# Altium schematic sheet cyc_v_som_B.SchDoc
size A3
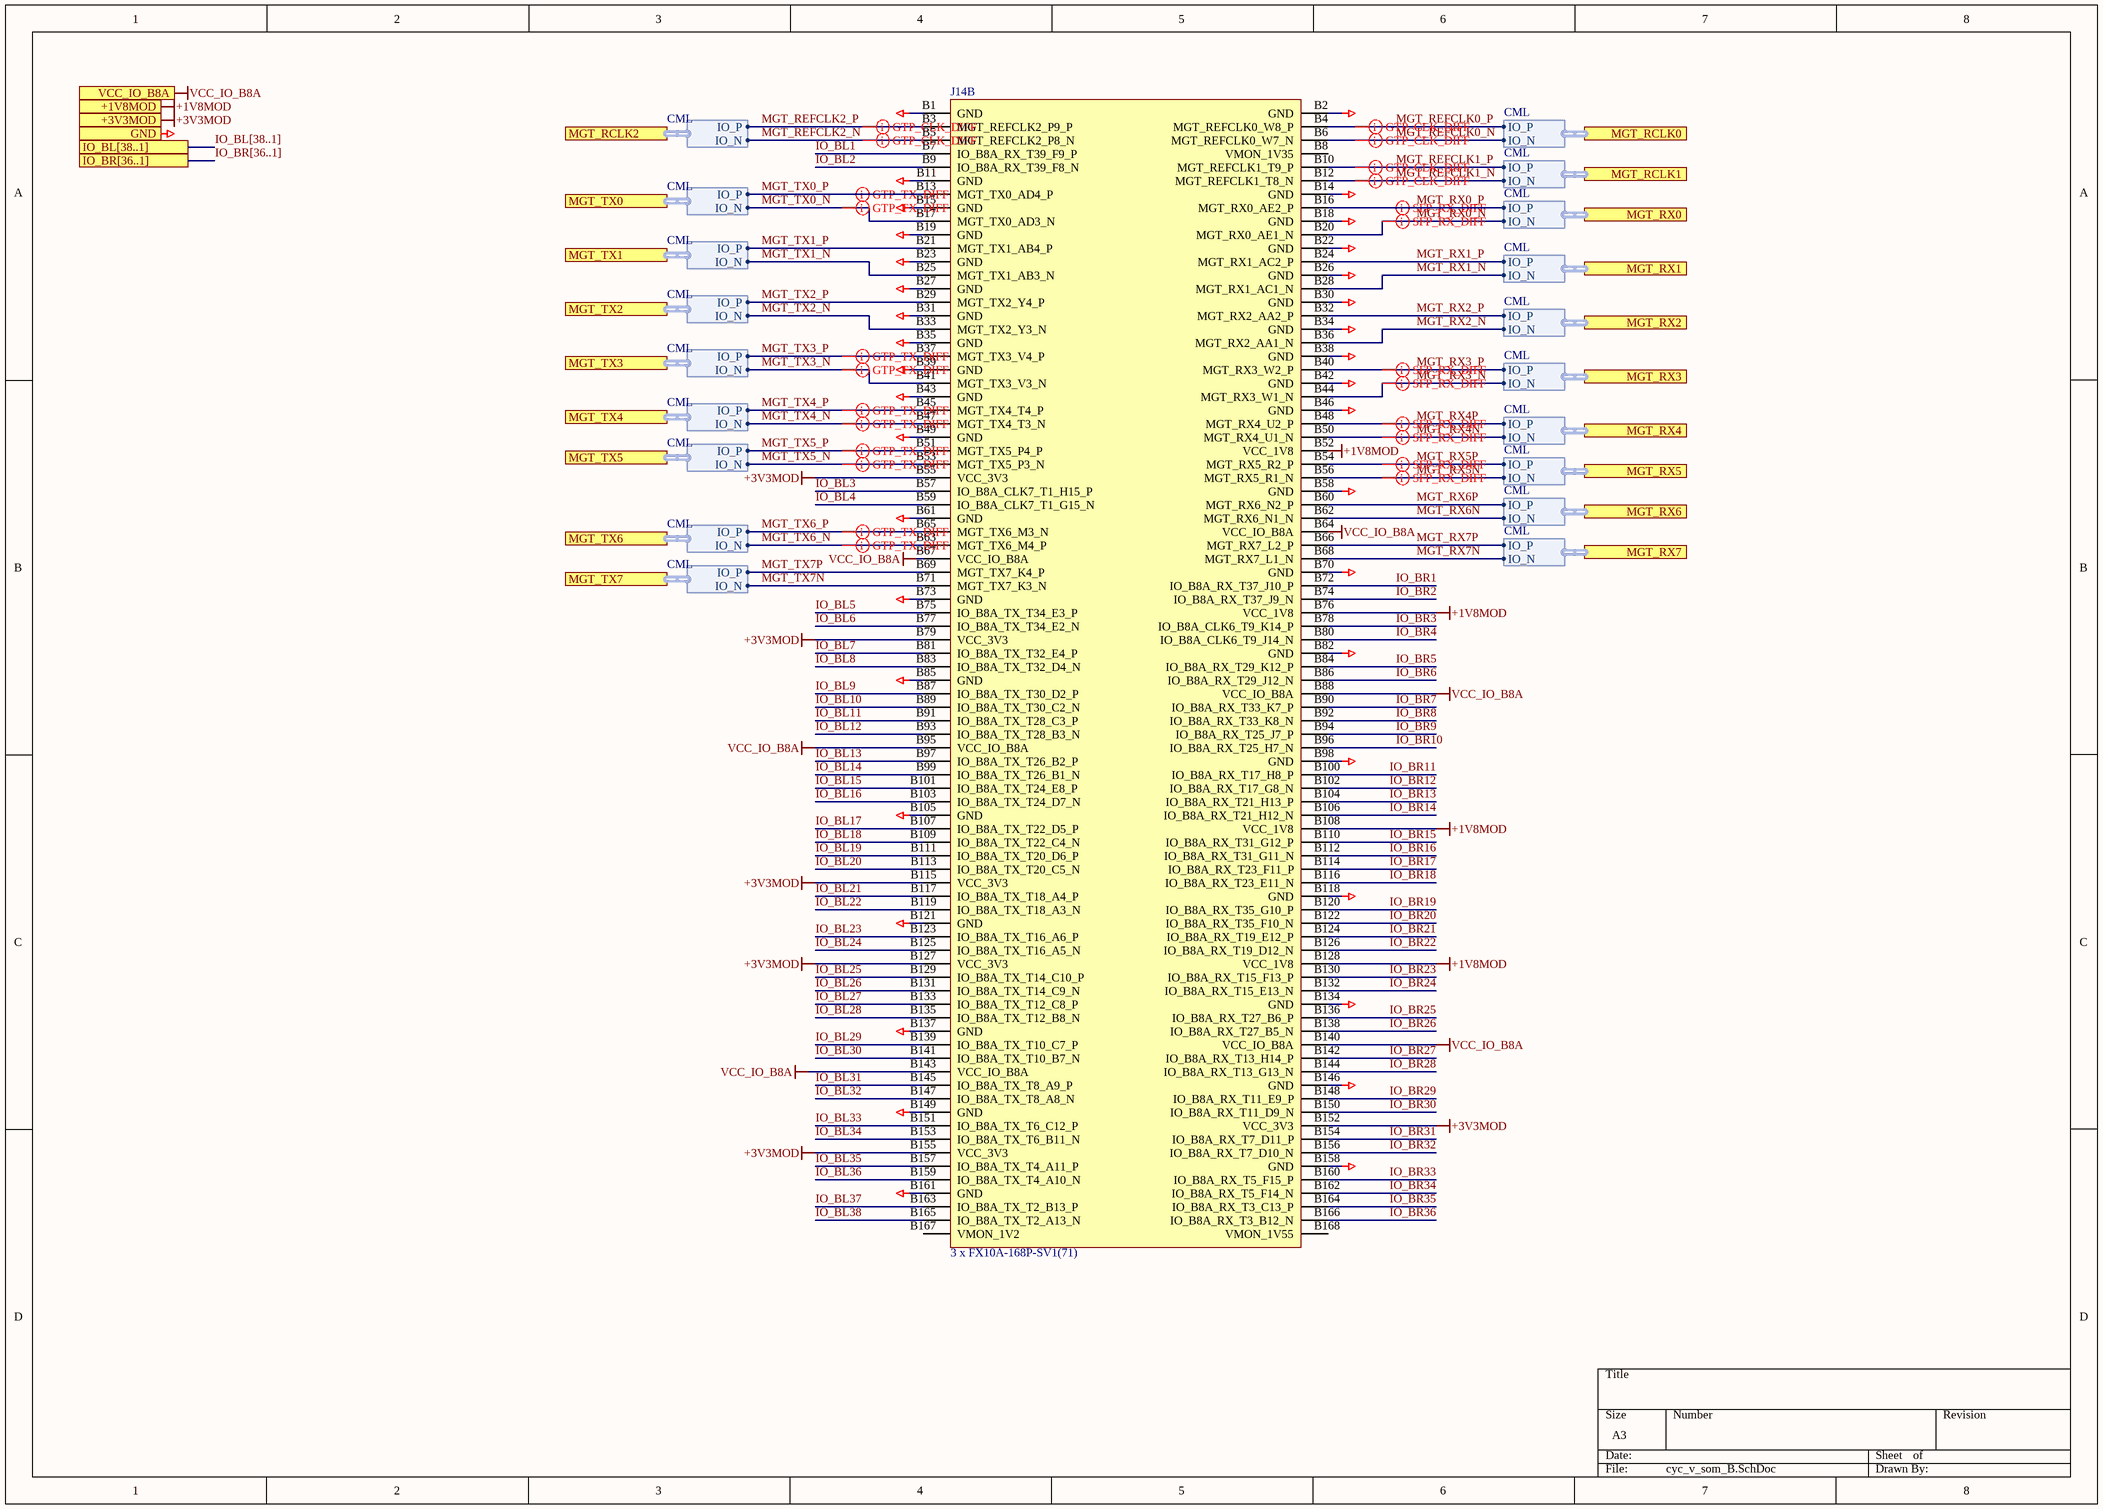
[diagram p0: cyc_v_som_B.SchDoc]

## Parts
J14  3 x FX10A-168P-SV1(71)  [Mercury_SA2p]  (part B of 4)

## Ports
+1V8MOD, +3V3MOD, GND, IO_BL[38..1], IO_BR[36..1], MGT_RCLK0 (harness CML), MGT_RCLK1 (harness CML), MGT_RCLK2 (harness CML), MGT_RX0 (harness CML), MGT_RX1 (harness CML), MGT_RX2 (harness CML), MGT_RX3 (harness CML), MGT_RX4 (harness CML), MGT_RX5 (harness CML), MGT_RX6 (harness CML), MGT_RX7 (harness CML), MGT_TX0 (harness CML), MGT_TX1 (harness CML), MGT_TX2 (harness CML), MGT_TX3 (harness CML), MGT_TX4 (harness CML), MGT_TX5 (harness CML), MGT_TX6 (harness CML), MGT_TX7 (harness CML), VCC_IO_B8A

## Harnesses
CML: IO_N, IO_P

## Nets
+1V8MOD: J14.B52(VCC_1V8) J14.B76(VCC_1V8) J14.B108(VCC_1V8) J14.B128(VCC_1V8) ; port +1V8MOD
+3V3MOD: J14.B55(VCC_3V3) J14.B79(VCC_3V3) J14.B115(VCC_3V3) J14.B127(VCC_3V3) J14.B152(VCC_3V3) J14.B155(VCC_3V3) ; port +3V3MOD
GND: J14.B1(GND) J14.B2(GND) J14.B11(GND) J14.B14(GND) J14.B15(GND) J14.B18(GND) J14.B19(GND) J14.B22(GND) J14.B23(GND) J14.B26(GND) J14.B27(GND) J14.B30(GND) J14.B31(GND) J14.B34(GND) J14.B35(GND) J14.B38(GND) J14.B39(GND) J14.B42(GND) J14.B43(GND) J14.B46(GND) J14.B49(GND) J14.B58(GND) J14.B61(GND) J14.B70(GND) J14.B73(GND) J14.B82(GND) J14.B85(GND) J14.B98(GND) J14.B105(GND) J14.B118(GND) J14.B121(GND) J14.B134(GND) J14.B137(GND) J14.B146(GND) J14.B149(GND) J14.B158(GND) J14.B161(GND) ; port GND
VCC_IO_B8A: J14.B64(VCC_IO_B8A) J14.B67(VCC_IO_B8A) J14.B88(VCC_IO_B8A) J14.B95(VCC_IO_B8A) J14.B140(VCC_IO_B8A) J14.B143(VCC_IO_B8A) ; port VCC_IO_B8A
IO_BL1: J14.B7(IO_B8A_RX_T39_F9_P)
IO_BL2: J14.B9(IO_B8A_RX_T39_F8_N)
IO_BL3: J14.B57(IO_B8A_CLK7_T1_H15_P)
IO_BL4: J14.B59(IO_B8A_CLK7_T1_G15_N)
IO_BL5: J14.B75(IO_B8A_TX_T34_E3_P)
IO_BL6: J14.B77(IO_B8A_TX_T34_E2_N)
IO_BL7: J14.B81(IO_B8A_TX_T32_E4_P)
IO_BL8: J14.B83(IO_B8A_TX_T32_D4_N)
IO_BL9: J14.B87(IO_B8A_TX_T30_D2_P)
IO_BL10: J14.B89(IO_B8A_TX_T30_C2_N)
IO_BL11: J14.B91(IO_B8A_TX_T28_C3_P)
IO_BL12: J14.B93(IO_B8A_TX_T28_B3_N)
IO_BL13: J14.B97(IO_B8A_TX_T26_B2_P)
IO_BL14: J14.B99(IO_B8A_TX_T26_B1_N)
IO_BL15: J14.B101(IO_B8A_TX_T24_E8_P)
IO_BL16: J14.B103(IO_B8A_TX_T24_D7_N)
IO_BL17: J14.B107(IO_B8A_TX_T22_D5_P)
IO_BL18: J14.B109(IO_B8A_TX_T22_C4_N)
IO_BL19: J14.B111(IO_B8A_TX_T20_D6_P)
IO_BL20: J14.B113(IO_B8A_TX_T20_C5_N)
IO_BL21: J14.B117(IO_B8A_TX_T18_A4_P)
IO_BL22: J14.B119(IO_B8A_TX_T18_A3_N)
IO_BL23: J14.B123(IO_B8A_TX_T16_A6_P)
IO_BL24: J14.B125(IO_B8A_TX_T16_A5_N)
IO_BL25: J14.B129(IO_B8A_TX_T14_C10_P)
IO_BL26: J14.B131(IO_B8A_TX_T14_C9_N)
IO_BL27: J14.B133(IO_B8A_TX_T12_C8_P)
IO_BL28: J14.B135(IO_B8A_TX_T12_B8_N)
IO_BL29: J14.B139(IO_B8A_TX_T10_C7_P)
IO_BL30: J14.B141(IO_B8A_TX_T10_B7_N)
IO_BL31: J14.B145(IO_B8A_TX_T8_A9_P)
IO_BL32: J14.B147(IO_B8A_TX_T8_A8_N)
IO_BL33: J14.B151(IO_B8A_TX_T6_C12_P)
IO_BL34: J14.B153(IO_B8A_TX_T6_B11_N)
IO_BL35: J14.B157(IO_B8A_TX_T4_A11_P)
IO_BL36: J14.B159(IO_B8A_TX_T4_A10_N)
IO_BL37: J14.B163(IO_B8A_TX_T2_B13_P)
IO_BL38: J14.B165(IO_B8A_TX_T2_A13_N)
IO_BR1: J14.B72(IO_B8A_RX_T37_J10_P)
IO_BR2: J14.B74(IO_B8A_RX_T37_J9_N)
IO_BR3: J14.B78(IO_B8A_CLK6_T9_K14_P)
IO_BR4: J14.B80(IO_B8A_CLK6_T9_J14_N)
IO_BR5: J14.B84(IO_B8A_RX_T29_K12_P)
IO_BR6: J14.B86(IO_B8A_RX_T29_J12_N)
IO_BR7: J14.B90(IO_B8A_RX_T33_K7_P)
IO_BR8: J14.B92(IO_B8A_RX_T33_K8_N)
IO_BR9: J14.B94(IO_B8A_RX_T25_J7_P)
IO_BR10: J14.B96(IO_B8A_RX_T25_H7_N)
IO_BR11: J14.B100(IO_B8A_RX_T17_H8_P)
IO_BR12: J14.B102(IO_B8A_RX_T17_G8_N)
IO_BR13: J14.B104(IO_B8A_RX_T21_H13_P)
IO_BR14: J14.B106(IO_B8A_RX_T21_H12_N)
IO_BR15: J14.B110(IO_B8A_RX_T31_G12_P)
IO_BR16: J14.B112(IO_B8A_RX_T31_G11_N)
IO_BR17: J14.B114(IO_B8A_RX_T23_F11_P)
IO_BR18: J14.B116(IO_B8A_RX_T23_E11_N)
IO_BR19: J14.B120(IO_B8A_RX_T35_G10_P)
IO_BR20: J14.B122(IO_B8A_RX_T35_F10_N)
IO_BR21: J14.B124(IO_B8A_RX_T19_E12_P)
IO_BR22: J14.B126(IO_B8A_RX_T19_D12_N)
IO_BR23: J14.B130(IO_B8A_RX_T15_F13_P)
IO_BR24: J14.B132(IO_B8A_RX_T15_E13_N)
IO_BR25: J14.B136(IO_B8A_RX_T27_B6_P)
IO_BR26: J14.B138(IO_B8A_RX_T27_B5_N)
IO_BR27: J14.B142(IO_B8A_RX_T13_H14_P)
IO_BR28: J14.B144(IO_B8A_RX_T13_G13_N)
IO_BR29: J14.B148(IO_B8A_RX_T11_E9_P)
IO_BR30: J14.B150(IO_B8A_RX_T11_D9_N)
IO_BR31: J14.B154(IO_B8A_RX_T7_D11_P)
IO_BR32: J14.B156(IO_B8A_RX_T7_D10_N)
IO_BR33: J14.B160(IO_B8A_RX_T5_F15_P)
IO_BR34: J14.B162(IO_B8A_RX_T5_F14_N)
IO_BR35: J14.B164(IO_B8A_RX_T3_C13_P)
IO_BR36: J14.B166(IO_B8A_RX_T3_B12_N)
MGT_REFCLK0_N: J14.B6(MGT_REFCLK0_W7_N) ; port MGT_RCLK0.IO_N
MGT_REFCLK0_P: J14.B4(MGT_REFCLK0_W8_P) ; port MGT_RCLK0.IO_P
MGT_REFCLK1_N: J14.B12(MGT_REFCLK1_T8_N) ; port MGT_RCLK1.IO_N
MGT_REFCLK1_P: J14.B10(MGT_REFCLK1_T9_P) ; port MGT_RCLK1.IO_P
MGT_REFCLK2_N: J14.B5(MGT_REFCLK2_P8_N) ; port MGT_RCLK2.IO_N
MGT_REFCLK2_P: J14.B3(MGT_REFCLK2_P9_P) ; port MGT_RCLK2.IO_P
MGT_RX0_N: J14.B20(MGT_RX0_AE1_N) ; port MGT_RX0.IO_N
MGT_RX0_P: J14.B16(MGT_RX0_AE2_P) ; port MGT_RX0.IO_P
MGT_RX1_N: J14.B28(MGT_RX1_AC1_N) ; port MGT_RX1.IO_N
MGT_RX1_P: J14.B24(MGT_RX1_AC2_P) ; port MGT_RX1.IO_P
MGT_RX2_N: J14.B36(MGT_RX2_AA1_N) ; port MGT_RX2.IO_N
MGT_RX2_P: J14.B32(MGT_RX2_AA2_P) ; port MGT_RX2.IO_P
MGT_RX3_N: J14.B44(MGT_RX3_W1_N) ; port MGT_RX3.IO_N
MGT_RX3_P: J14.B40(MGT_RX3_W2_P) ; port MGT_RX3.IO_P
MGT_RX4N: J14.B50(MGT_RX4_U1_N) ; port MGT_RX4.IO_N
MGT_RX4P: J14.B48(MGT_RX4_U2_P) ; port MGT_RX4.IO_P
MGT_RX5N: J14.B56(MGT_RX5_R1_N) ; port MGT_RX5.IO_N
MGT_RX5P: J14.B54(MGT_RX5_R2_P) ; port MGT_RX5.IO_P
MGT_RX6N: J14.B62(MGT_RX6_N1_N) ; port MGT_RX6.IO_N
MGT_RX6P: J14.B60(MGT_RX6_N2_P) ; port MGT_RX6.IO_P
MGT_RX7N: J14.B68(MGT_RX7_L1_N) ; port MGT_RX7.IO_N
MGT_RX7P: J14.B66(MGT_RX7_L2_P) ; port MGT_RX7.IO_P
MGT_TX0_N: J14.B17(MGT_TX0_AD3_N) ; port MGT_TX0.IO_N
MGT_TX0_P: J14.B13(MGT_TX0_AD4_P) ; port MGT_TX0.IO_P
MGT_TX1_N: J14.B25(MGT_TX1_AB3_N) ; port MGT_TX1.IO_N
MGT_TX1_P: J14.B21(MGT_TX1_AB4_P) ; port MGT_TX1.IO_P
MGT_TX2_N: J14.B33(MGT_TX2_Y3_N) ; port MGT_TX2.IO_N
MGT_TX2_P: J14.B29(MGT_TX2_Y4_P) ; port MGT_TX2.IO_P
MGT_TX3_N: J14.B41(MGT_TX3_V3_N) ; port MGT_TX3.IO_N
MGT_TX3_P: J14.B37(MGT_TX3_V4_P) ; port MGT_TX3.IO_P
MGT_TX4_N: J14.B47(MGT_TX4_T3_N) ; port MGT_TX4.IO_N
MGT_TX4_P: J14.B45(MGT_TX4_T4_P) ; port MGT_TX4.IO_P
MGT_TX5_N: J14.B53(MGT_TX5_P3_N) ; port MGT_TX5.IO_N
MGT_TX5_P: J14.B51(MGT_TX5_P4_P) ; port MGT_TX5.IO_P
MGT_TX6_N: J14.B63(MGT_TX6_M4_P) ; port MGT_TX6.IO_N
MGT_TX6_P: J14.B65(MGT_TX6_M3_N) ; port MGT_TX6.IO_P
MGT_TX7N: J14.B71(MGT_TX7_K3_N) ; port MGT_TX7.IO_N
MGT_TX7P: J14.B69(MGT_TX7_K4_P) ; port MGT_TX7.IO_P

Not connected (* = marked no-connect by the designer): J14 B8(VMON_1V35) B167(VMON_1V2) B168(VMON_1V55)

## Buses and harness runs
bus IO_BL[38..1] = port IO_BL[38..1]
bus IO_BR[36..1] = port IO_BR[36..1]

## Layout directives
differential pair; rule Differential Pairs Routing [Pref Gap = 0.175mm    Min Gap  = 0.075mm    Max Gap  = 0.5mmPref Width = 0.25mm    Min Width  = 0.075mm    Max Width  = 0.5mm]: MGT_REFCLK0_N, MGT_REFCLK0_P, MGT_REFCLK1_N, MGT_REFCLK1_P, MGT_REFCLK2_N, MGT_REFCLK2_P, MGT_RX0_N, MGT_RX0_P, MGT_RX3_N, MGT_RX3_P, MGT_RX4N, MGT_RX4P, MGT_RX5N, MGT_RX5P, MGT_TX0_N, MGT_TX0_P, MGT_TX3_N, MGT_TX3_P, MGT_TX4_N, MGT_TX4_P, MGT_TX5_N, MGT_TX5_P, MGT_TX6_N, MGT_TX6_P

## Library data of the parts
J14 = FX10A-168P-SV_ME-SA2+: Pin_Count: 168; SolderOption: 0; Pkg: SMD 170pin; SMD Solders: 170; HelpURL: https://www.hirose.com/product/document?clcode=CL0570-0044-8-71&productname=FX10A-168P-SV(71)&series=FX10&documenttype=Catalog&lang=ru&documentid=D31650_en; PartField: FX10A-168P-SV1(71); Value: 3 x FX10A-168P-SV1(71); THD Solders: 0